# EAGLE design Application_Board (EAGLE 6.4)
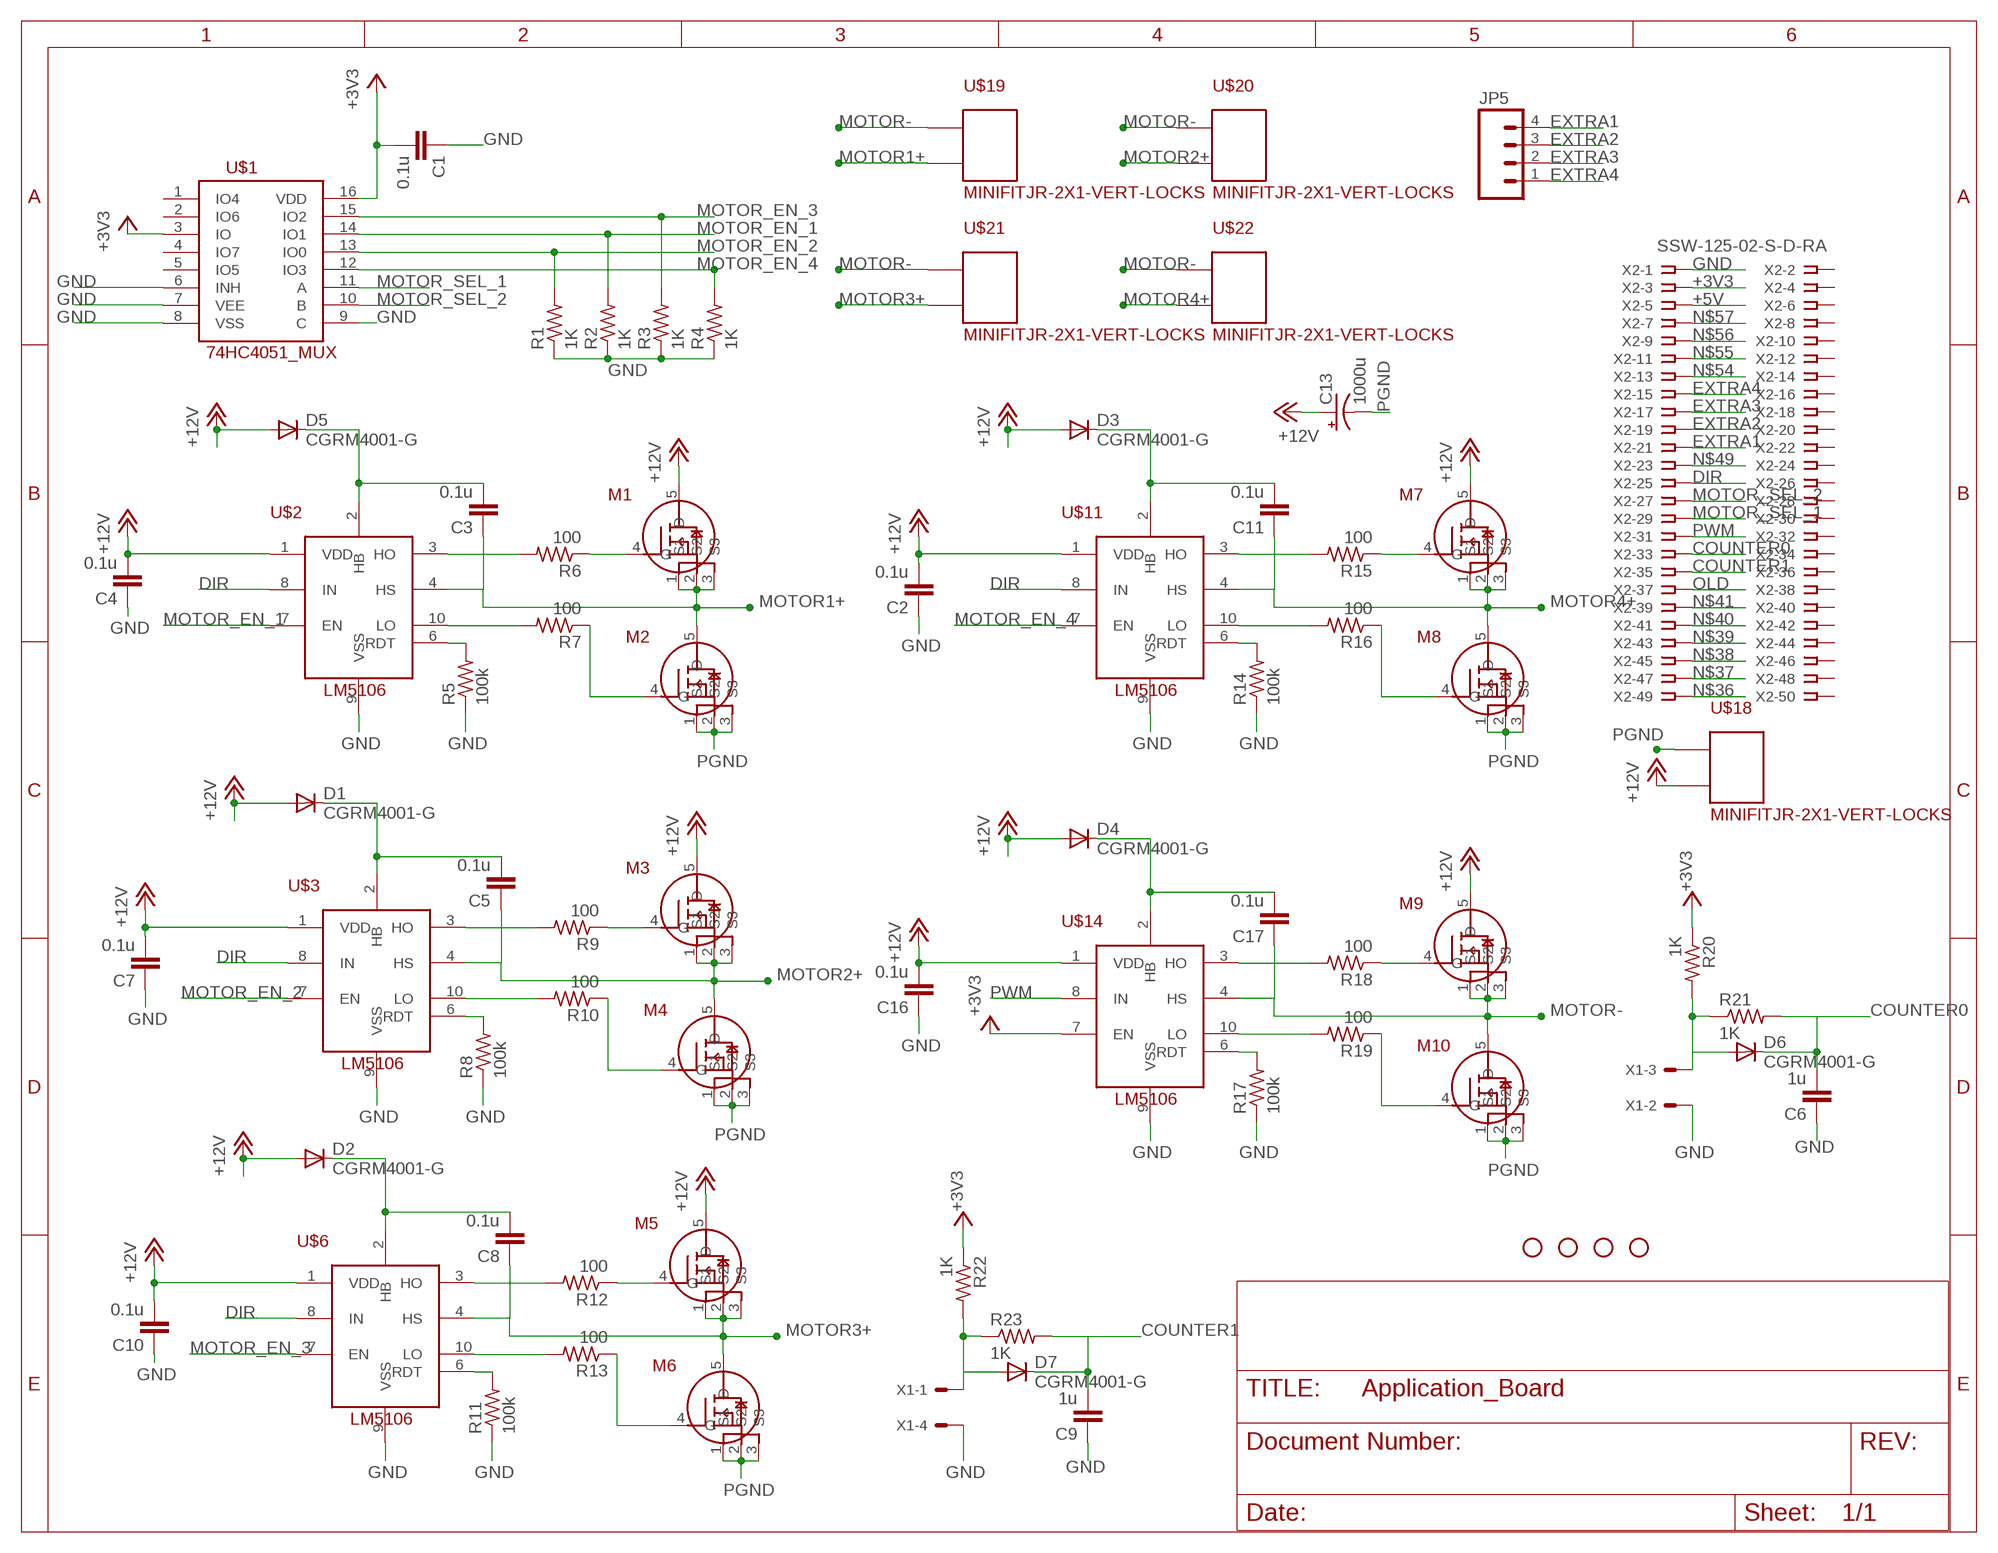
[diagram p0: schematic, sheet 1]

## Parts
C1  0.1u  CAP0805  [0805]
C2  0.1u  CAP0805  [0805]
C3  0.1u  CAP0805  [0805]
C4  0.1u  CAP0805  [0805]
C5  0.1u  CAP0805  [0805]
C6  1u  CAP0805  [0805]
C7  0.1u  CAP0805  [0805]
C8  0.1u  CAP0805  [0805]
C9  1u  CAP0805  [0805]
C10  0.1u  CAP0805  [0805]
C11  0.1u  CAP0805  [0805]
C13  1000u  CPOL-US  [UD-18X19,1_NICHICON]
C16  0.1u  CAP0805  [0805]
C17  0.1u  CAP0805  [0805]
D1  CGRM4001-G  [SOD-123_MINI-SMA]
D2  CGRM4001-G  [SOD-123_MINI-SMA]
D3  CGRM4001-G  [SOD-123_MINI-SMA]
D4  CGRM4001-G  [SOD-123_MINI-SMA]
D5  CGRM4001-G  [SOD-123_MINI-SMA]
D6  CGRM4001-G  [SOD-123_MINI-SMA]
D7  CGRM4001-G  [SOD-123_MINI-SMA]
JP1  STAND-OFF  [STAND-OFF]
JP2  STAND-OFF  [STAND-OFF]
JP3  STAND-OFF  [STAND-OFF]
JP4  STAND-OFF  [STAND-OFF]
JP5  M041X04_NO_SILK  [1X04_NO_SILK]
M1  M  PSMN2R0-30YL  [TO127P600X120-5N]
M2  M  PSMN2R0-30YL  [TO127P600X120-5N]
M3  M  PSMN2R0-30YL  [TO127P600X120-5N]
M4  M  PSMN2R0-30YL  [TO127P600X120-5N]
M5  M  PSMN2R0-30YL  [TO127P600X120-5N]
M6  M  PSMN2R0-30YL  [TO127P600X120-5N]
M7  M  PSMN2R0-30YL  [TO127P600X120-5N]
M8  M  PSMN2R0-30YL  [TO127P600X120-5N]
M9  M  PSMN2R0-30YL  [TO127P600X120-5N]
M10  M  PSMN2R0-30YL  [TO127P600X120-5N]
R1  1K  R-US_R0805  [R0805]
R2  1K  R-US_R0805  [R0805]
R3  1K  R-US_R0805  [R0805]
R4  1K  R-US_R0805  [R0805]
R5  100k  R-US_R0805  [R0805]
R6  100  R-US_R0805  [R0805]
R7  100  R-US_R0805  [R0805]
R8  100k  R-US_R0805  [R0805]
R9  100  R-US_R0805  [R0805]
R10  100  R-US_R0805  [R0805]
R11  100k  R-US_R0805  [R0805]
R12  100  R-US_R0805  [R0805]
R13  100  R-US_R0805  [R0805]
R14  100k  R-US_R0805  [R0805]
R15  100  R-US_R0805  [R0805]
R16  100  R-US_R0805  [R0805]
R17  100k  R-US_R0805  [R0805]
R18  100  R-US_R0805  [R0805]
R19  100  R-US_R0805  [R0805]
R20  1K  R-US_R0805  [R0805]
R21  1K  R-US_R0805  [R0805]
R22  1K  R-US_R0805  [R0805]
R23  1K  R-US_R0805  [R0805]
U$1  74HC4051_MUX  [SO16]
U$2  LM5106MMSMD-MSOP  [10-MSOP]
U$3  LM5106MMSMD-MSOP  [10-MSOP]
U$6  LM5106MMSMD-MSOP  [10-MSOP]
U$11  LM5106MMSMD-MSOP  [10-MSOP]
U$14  LM5106MMSMD-MSOP  [10-MSOP]
U$18  MINIFITJR-2X1-VERT-LOCKS  [5566-02A2]
U$19  MINIFITJR-2X1-VERT-LOCKS  [5566-02A2]
U$20  MINIFITJR-2X1-VERT-LOCKS  [5566-02A2]
U$21  MINIFITJR-2X1-VERT-LOCKS  [5566-02A2]
U$22  MINIFITJR-2X1-VERT-LOCKS  [5566-02A2]
X1  KK-156-4  [KK-156-4]
X2  SSW-125-02-S-D-RA  [TSW-125-02-S-D-RA]

## Nets
+3V3: C1.2 R20.1 R22.1 U$1.3(IO) U$1.16(VDD) U$14.7(EN) X2.3
+5V: X2.5
+12V: C2.2 C4.2 C7.2 C10.2 C13.+ C16.2 D1.A D2.A D3.A D4.A D5.A M1.5(D) M3.5(D) M5.5(D) M7.5(D) M9.5(D) U$2.1(VDD) U$3.1(VDD) U$6.1(VDD) U$11.1(VDD) U$14.1(VDD) U$18.P$2
COUNTER0: C6.2 D6.C R21.2 X2.33
COUNTER1: C9.2 D7.C R23.2 X2.35
DIR: U$2.8(IN) U$3.8(IN) U$6.8(IN) U$11.8(IN) X2.25
EXTRA1: JP5.4 X2.21
EXTRA2: JP5.3 X2.19
EXTRA3: JP5.2 X2.17
EXTRA4: JP5.1 X2.15
GND: C1.1 C2.1 C4.1 C6.1 C7.1 C9.1 C10.1 C16.1 R1.1 R2.1 R3.1 R4.1 R5.1 R8.1 R11.1 R14.1 R17.1 U$1.6(INH) U$1.7(VEE) U$1.8(VSS) U$1.9(C) U$2.9(VSS) U$3.9(VSS) U$6.9(VSS) U$11.9(VSS) U$14.9(VSS) X1.2 X1.4 X2.1
MOTOR1+: C3.1 M1.1(S1) M1.2(S2) M1.3(S3) M2.5(D) U$2.4(HS) U$19.P$2
MOTOR2+: C5.1 M3.1(S1) M3.2(S2) M3.3(S3) M4.5(D) U$3.4(HS) U$20.P$2
MOTOR3+: C8.1 M5.1(S1) M5.2(S2) M5.3(S3) M6.5(D) U$6.4(HS) U$21.P$2
MOTOR4+: C11.1 M7.1(S1) M7.2(S2) M7.3(S3) M8.5(D) U$11.4(HS) U$22.P$2
MOTOR-: C17.1 M9.1(S1) M9.2(S2) M9.3(S3) M10.5(D) U$14.4(HS) U$19.P$1 U$20.P$1 U$21.P$1 U$22.P$1
MOTOR_EN_1: R2.2 U$1.14(IO1) U$2.7(EN)
MOTOR_EN_2: R1.2 U$1.13(IO0) U$3.7(EN)
MOTOR_EN_3: R3.2 U$1.15(IO2) U$6.7(EN)
MOTOR_EN_4: R4.2 U$1.12(IO3) U$11.7(EN)
MOTOR_SEL_1: U$1.11(A) X2.29
MOTOR_SEL_2: U$1.10(B) X2.27
N$1: C3.2 D5.C U$2.2(HB)
N$2: R9.2 U$3.3(HO)
N$3: R10.2 U$3.10(LO)
N$4: M1.4(G) R6.1
N$5: R5.2 U$2.6(RDT)
N$6: C5.2 D1.C U$3.2(HB)
N$7: R8.2 U$3.6(RDT)
N$8: M2.4(G) R7.1
N$9: M3.4(G) R9.1
N$10: M4.4(G) R10.1
N$11: R12.2 U$6.3(HO)
N$12: R13.2 U$6.10(LO)
N$13: C8.2 D2.C U$6.2(HB)
N$14: R11.2 U$6.6(RDT)
N$15: M5.4(G) R12.1
N$16: M6.4(G) R13.1
N$17: R15.2 U$11.3(HO)
N$18: R16.2 U$11.10(LO)
N$19: C11.2 D3.C U$11.2(HB)
N$20: R14.2 U$11.6(RDT)
N$21: M7.4(G) R15.1
N$22: M8.4(G) R16.1
N$23: R18.2 U$14.3(HO)
N$24: R19.2 U$14.10(LO)
N$25: C17.2 D4.C U$14.2(HB)
N$26: R17.2 U$14.6(RDT)
N$27: M9.4(G) R18.1
N$28: M10.4(G) R19.1
N$29: D7.A R22.2 R23.1 X1.1
N$30: D6.A R20.2 R21.1 X1.3
N$36: X2.49
N$37: X2.47
N$38: X2.45
N$39: X2.43
N$40: X2.41
N$41: X2.39
N$49: X2.23
N$54: X2.13
N$55: X2.11
N$56: X2.9
N$57: X2.7
N$67: R6.2 U$2.3(HO)
N$69: R7.2 U$2.10(LO)
OLD: X2.37
PGND: C13.- M2.1(S1) M2.2(S2) M2.3(S3) M4.1(S1) M4.2(S2) M4.3(S3) M6.1(S1) M6.2(S2) M6.3(S3) M8.1(S1) M8.2(S2) M8.3(S3) M10.1(S1) M10.2(S2) M10.3(S3) U$18.P$1
PWM: U$14.8(IN) X2.31
Unconnected: U$1.1(IO4) U$1.2(IO6) U$1.4(IO7) U$1.5(IO5) X2.2 X2.4 X2.6 X2.8 X2.10 X2.12 X2.14 X2.16 X2.18 X2.20 X2.22 X2.24 X2.26 X2.28 X2.30 X2.32 X2.34 X2.36 X2.38 X2.40 X2.42 X2.44 X2.46 X2.48 X2.50

## Library data of the parts
C1-C11 C16 C17 = SparkFun-Capacitors:CAP: Capacitor Standard 0603 ceramic capacitor, and 0.1" leaded capacitor.
C13 = large_cap:CPOL-US: POLARIZED CAPACITOR, American symbol
D1-D7 = diode:CGRM400*-G: Molded plasitc,JEDEC SOD-123/Mini SMA Source: Comchip CGRM4001-G.pdf
JP1-JP4 = SparkFun:STAND-OFF: Stand Off This is the mechanical footprint for a #4 phillips button head screw. Use the keepout ring to avoid running the screw head into surrounding components. SKU : PRT-00447
JP5 = SparkFun-Connectors:M04: Header 4 Standard 4-pin 0.1" header. Use with straight break away headers (SKU : PRT-00116), right angle break away headers (PRT-00553), swiss pins (PRT-00743), machine pins (PRT-00117), and female headers (PRT-00115). Molex polarized connector foot print use with SKU : PRT-08231 with associated crimp pins and housings. 1MM SMD Version SKU: PRT-10208
M1-M10 = nxp_sot669:PSMN2R0-30YL: PSMN2RO-30YL A motor driver N-channel MOSFET from NXP Semiconductor.
R1-R23 = rcl:R-US_: RESISTOR, American symbol
U$1 = SparkFun-AnalogIC:74HC4051_MUX: 8:1 analog mux
U$2 U$3 U$6 U$11 U$14 = half-bridge:LM5106MM: 100V Half Bridge Gate Driver TI LM5106 driver with programmable dead-time
U$18-U$22 = Personal:MINIFITJR-2X1-VERT-LOCKS
X1 = con-molex:KK-156-4: KK 156 HEADER Source: http://www.molex.com/pdm_docs/sd/026604100_sd.pdf; OC_FARNELL: unknown; OC_NEWARK: unknown
X2 = con-samtec:SSW-125-02-S-D: THROUGH-HOLE .025" SQ POST SOCKET Source: Samtec SSW.pdf; MPN: SSW-125-02-S-D-RA; OC_FARNELL: unknown; OC_NEWARK: 11P9724

## Board
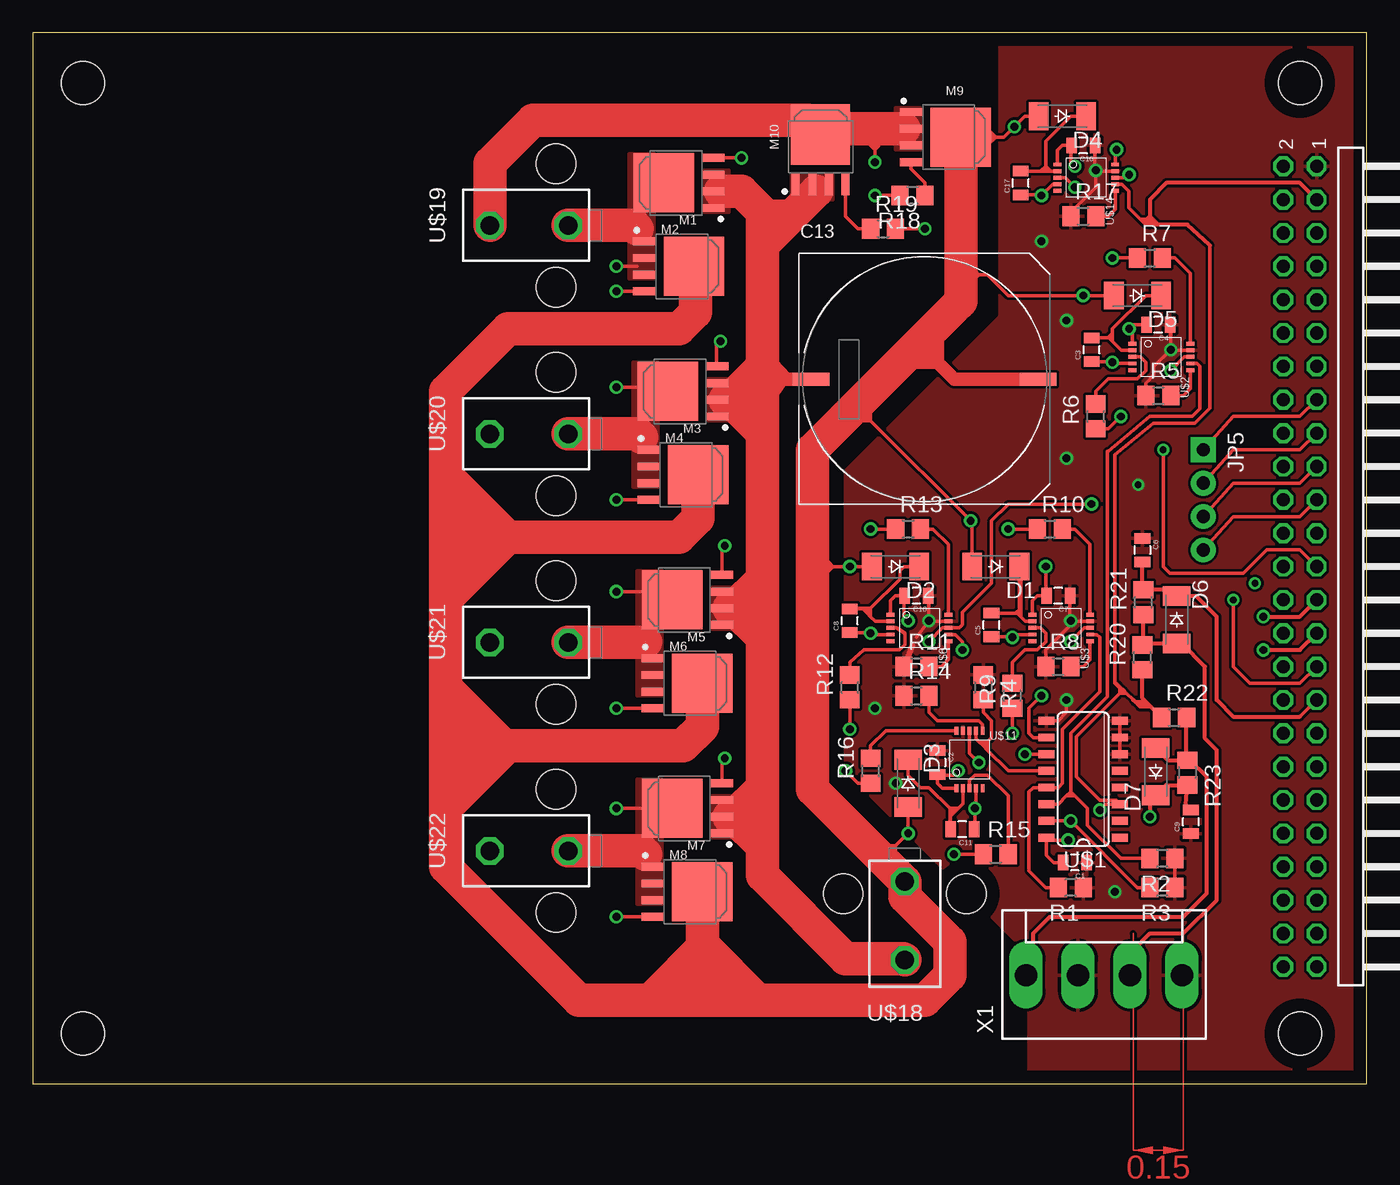
[diagram p1: board, top side]
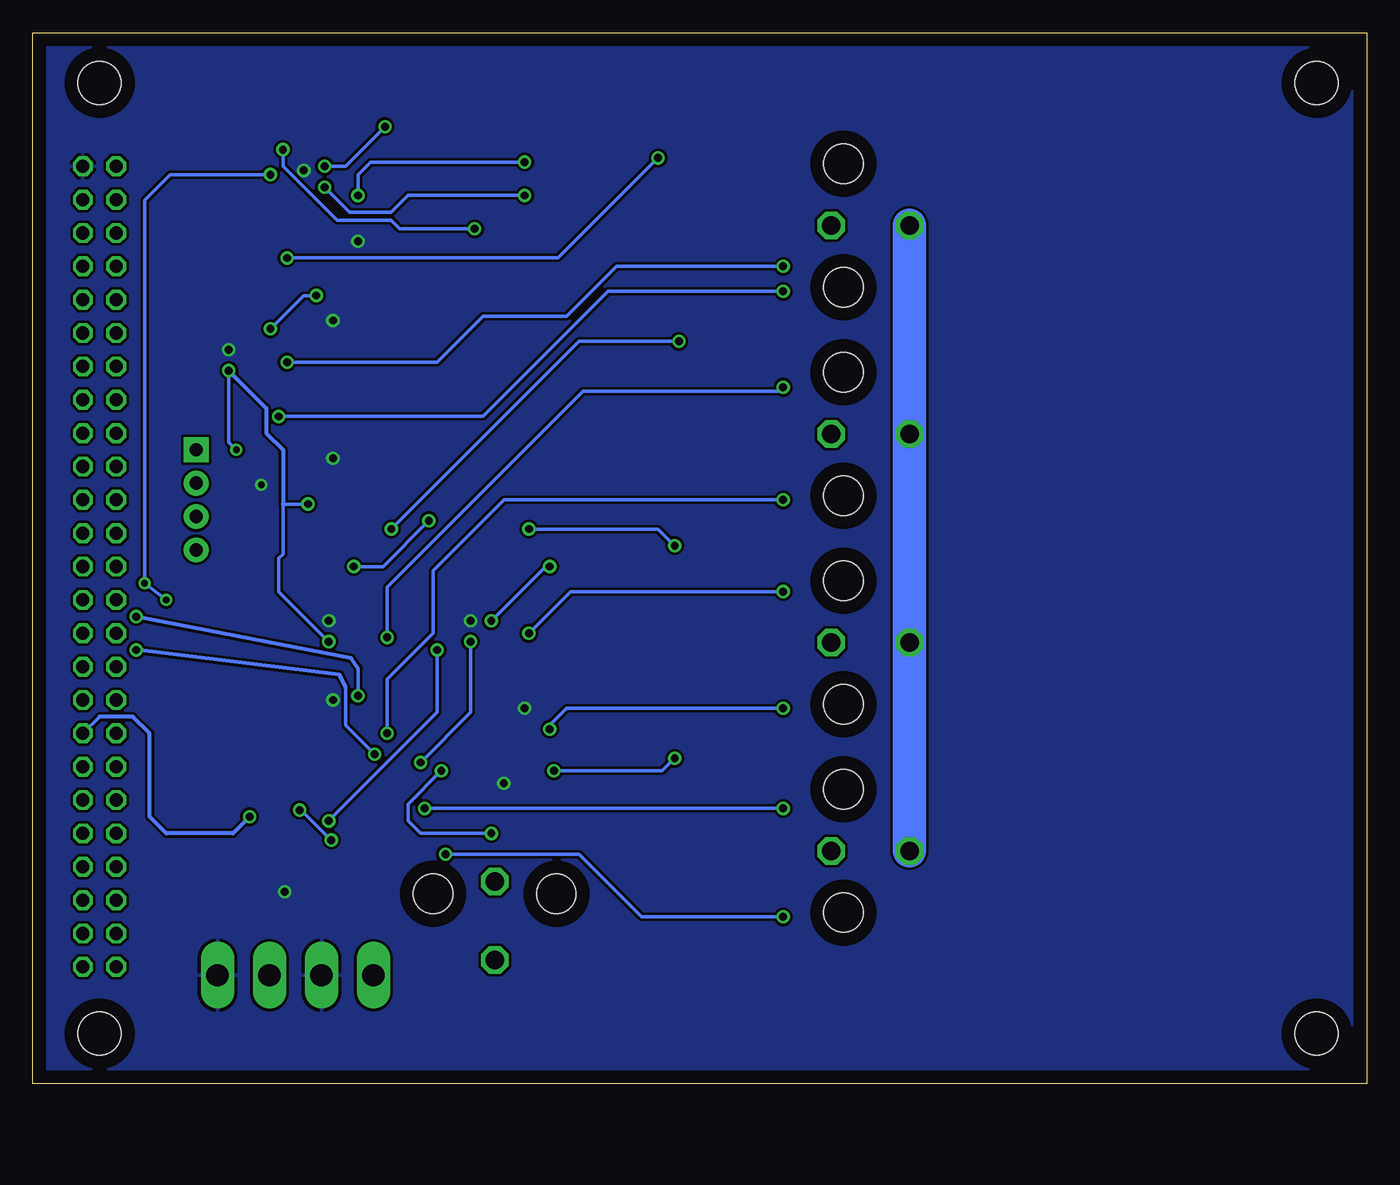
[diagram p2: board, bottom side, seen from below]

Size 101.6 x 80.01 mm. Coordinates in mm from the lower left corner, seen from the top.
Outline: 0,80.01 0,0 101.6,0 101.6,80.01 0,80.01
Copper layers (1*16): Top 0.035mm / dielectric 1.5mm / Bottom 0.035mm
Design rules "default": minimum track width 10mil, minimum drill 15mil, track to track 8mil, track to pad 8mil, pad to pad 8mil, via to via 8mil, smd to smd 8mil, copper to edge 40mil, drill to drill 8mil, minimum pad ring 10mil, minimum via ring 8mil, stop-mask expansion 4mil, vias tented up to drill 0mil, thermal gap 10mil

### Footprints (pad centres in the part's own frame; a part is rotated, then mirrored left to right if it is on the bottom)
0805 = smd 0.8 x 1.2: 1 -0.9,0; 2 0.9,0
UD-18X19,1_NICHICON = smd 2.8 x 1: + 18.15,10.775; - 0.85,10.775
SOD-123_MINI-SMA = smd 1.5 x 2.1: A 1.8,0; C -1.8,0
STAND-OFF = hole 3.302: 0,0
1X04_NO_SILK = drill 1.016 pad 1.88 square: 1 0,0 | drill 1.016 pad 1.88: 2 2.54,0; 3 5.08,0; 4 7.62,0
TO127P600X120-5N = smd 1.65 x 0.6: 1 -2.65,1.905; 2 -2.65,0.635; 3 -2.65,-0.635; 4 -2.65,-1.905 | smd 4.6 x 4.5: 5 1.15,0
R0805 = smd 1.3 x 1.5: 1 -0.95,0; 2 0.95,0
SO16 = smd 0.6 x 1.2: 1 -4.445,-2.8; 2 -3.175,-2.8; 3 -1.905,-2.8; 4 -0.635,-2.8; 5 0.635,-2.8; 6 1.905,-2.8; 7 3.175,-2.8; 8 4.445,-2.8; 9 4.445,2.8; 10 3.175,2.8; 11 1.905,2.8; 12 0.635,2.8; 13 -0.635,2.8; 14 -1.905,2.8; 15 -3.175,2.8; 16 -4.445,2.8
10-MSOP = smd 0.3 x 0.6: 1 0.5,-0.7; 2 1,-0.7; 3 1.5,-0.7; 4 2,-0.7; 5 2.5,-0.7; 6 2.5,3.7; 7 2,3.7; 8 1.5,3.7; 9 1,3.7; 10 0.5,3.7
5566-02A2 = drill 1.4 octagon: P$1 -4.7,-5.5; P$2 -4.7,0.46 | hole 3: -9.4,-0.46; 0,-0.46
KK-156-4 = drill 1.7 pad 2.184 long: 1 -5.94,0; 2 -1.98,0; 3 1.98,0; 4 5.94,0
TSW-125-02-S-D-RA = drill 1 pad 1.5 octagon: 1 30.48,1.524; 2 30.48,4.064; 3 27.94,1.524; 4 27.94,4.064; 5 25.4,1.524; 6 25.4,4.064; 7 22.86,1.524; 8 22.86,4.064; 9 20.32,1.524; 10 20.32,4.064; 11 17.78,1.524; 12 17.78,4.064; 13 15.24,1.524; 14 15.24,4.064; 15 12.7,1.524; 16 12.7,4.064; 17 10.16,1.524; 18 10.16,4.064; 19 7.62,1.524; 20 7.62,4.064; 21 5.08,1.524; 22 5.08,4.064; 23 2.54,1.524; 24 2.54,4.064; 25 0,1.524; 26 0,4.064; 27 -2.54,1.524; 28 -2.54,4.064; 29 -5.08,1.524; 30 -5.08,4.064; 31 -7.62,1.524; 32 -7.62,4.064; 33 -10.16,1.524; 34 -10.16,4.064; 35 -12.7,1.524; 36 -12.7,4.064; 37 -15.24,1.524; 38 -15.24,4.064; 39 -17.78,1.524; 40 -17.78,4.064; 41 -20.32,1.524; 42 -20.32,4.064; 43 -22.86,1.524; 44 -22.86,4.064; 45 -25.4,1.524; 46 -25.4,4.064; 47 -27.94,1.524; 48 -27.94,4.064; 49 -30.48,1.524; 50 -30.48,4.064

### Placement (x,y rotation side)
C1  79.38,16.83 180 top
C2  68.9,24.45 270 top
C3  80.64,55.88 90 top
C4  85.72,57.79 180 top
C5  73.03,34.93 90 top
C6  84.51,40.62 270 top
C7  78.11,37.15 180 top
C8  62.23,35.24 90 top
C9  88.2,19.94 90 top
C10  67.31,37.15 180 top
C11  70.8,19.37 180 top
C13  58.42,42.86 0 top
C16  80.01,71.44 180 top
C17  75.25,68.58 90 top
D1  73.34,39.37 180 top
D2  65.72,39.37 180 top
D3  66.67,22.86 270 top
D4  78.42,73.66 180 top
D5  84.14,60.01 180 top
D6  87.13,35.32 270 top
D7  85.53,23.75 90 top
JP1  3.81,3.81 0 top
JP2  96.52,3.81 0 top
JP3  3.81,76.2 0 top
JP4  96.52,76.2 0 top
JP5  89.15,48.26 270 top
M1  49.21,62.23 0 top
M2  49.21,68.58 180 top
M3  49.53,46.36 0 top
M4  49.53,52.71 180 top
M5  49.85,30.48 0 top
M6  49.85,36.83 180 top
M7  49.85,14.61 0 top
M8  49.85,20.96 180 top
M9  69.53,72.07 0 top
M10  60.01,71.12 90 top
R1  79.06,14.92 180 top
R2  86.04,17.15 180 top
R3  86.04,14.92 180 top
R4  72.39,30.16 270 top
R5  85.72,52.39 0 top
R6  80.96,50.8 90 top
R7  85.09,62.87 0 top
R8  78.11,31.75 0 top
R9  74.61,29.53 90 top
R10  77.47,42.23 0 top
R11  67.31,31.75 0 top
R12  62.23,30.16 90 top
R13  66.67,42.23 0 top
R14  67.31,29.53 0 top
R15  73.34,17.46 0 top
R16  63.82,23.81 90 top
R17  80.01,66.04 0 top
R18  66.99,67.63 180 top
R19  64.77,65.09 0 top
R20  84.52,32.45 90 top
R21  84.59,36.66 90 top
R22  86.93,27.88 0 top
R23  87.95,23.69 270 top
U$1  80.01,23.18 90 top
U$2  84.45,56.83 270 top
U$3  76.83,36.2 270 top
U$6  66.04,36.2 270 top
U$11  69.85,23.18 0 top
U$14  78.74,70.49 270 top
U$18  71.12,14.92 0 top
U$19  40.32,60.64 270 top
U$20  40.32,44.77 270 top
U$21  40.32,28.89 270 top
U$22  40.32,13.02 270 top
X1  81.6,8.26 0 top
X2  99.31,39.37 90 top

### Tracks (layer width: path | path; a pad name or v marks a point on that pad's centre or on a via)
+3V3  (via drill 0.6)
  Top 0.254: 78.42,16.83 77.79,16.83 77.21,17.41 U$1.16 77.4,18.54 v78.87,18.54 | 89.66,63.82 89.66,51.44 88.52,50.29 85.34,50.29 82.42,47.88 82.42,30.61 | 85.72,65.41 85.09,65.41 84.77,65.41 83.5,66.68 83.5,67.95 82.96,68.49 U$14.7 | 82.42,30.61 82.42,30.48 | 83.06,29.97 83.31,29.72 | 83.31,29.72 83.82,29.21 84.33,28.7 | v81.28,20.83 81.72,21.27 U$1.3 | 82.87,21.27 82.55,21.59 81.28,21.59 79.5,23.37 79.5,26.42 82.8,29.72 | 82.8,29.72 83.06,29.97 | 83.06,29.97 82.8,30.23 | 82.8,30.23 82.55,30.48 | 82.42,30.61 82.55,30.48 | 82.55,30.48 82.42,30.48 | 82.42,30.48 82.93,29.97 | 82.8,30.23 82.8,29.72 | 83.31,29.72 82.8,29.72
  Top 0.305: X2.3 96.52,68.58 86.36,68.58 85.09,67.31 85.09,66.04 | 85.09,66.04 85.09,65.41 | 84.84,65.79 84.71,65.66 84.84,65.53 85.34,65.53 | 85.09,66.04 85.72,65.41 87.95,65.41 89.66,63.82 | 85.09,66.04 84.84,65.79 | 84.84,65.79 84.45,65.79 | 85.16,28.7 84.33,28.7 | R22.1 85.16,28.7 | 85.16,28.7 84.52,29.34 R20.1 | 83.82,29.21 83.95,29.08 84.71,29.08 84.71,28.83 84.58,28.96 84.33,28.96
  Top 0.406: 82.87,21.27 U$1.3 | C1.2 78.42,16.83
  Bottom 0.254: v78.87,18.54 81.15,20.83 v81.28,20.83
+12V  (via drill 0.6)
  Top 0.254: U$14.1 78.04,71.06 78.42,71.44 79.06,71.44 | U$3.1 76.14,36.77 76.52,37.15 77.15,37.15 | 77.15,37.15 C7.2 | U$6.1 65.34,36.77 65.72,37.15 66.36,37.15 66.36,35.56 v66.67,35.24 | U$11.1 69.28,22.48 68.9,22.86 68.9,23.5 | 68.9,23.5 C2.2 | 65.72,18.1 v66.67,19.05 D3.A | 65.72,18.1 64.71,17.09 | 65.41,18.1 65.72,18.1 | 65.72,18.1 65.72,17.46 | D1.A 71.54,42.76 v71.44,42.86 63.82,50.48 | 63.82,50.48 63.5,50.8 | 63.5,50.8 62.55,50.8 | 62.87,50.17 63.18,50.48 | 63.18,50.48 63.5,50.8 | D4.A 75.56,73.66 v74.77,72.87 73.98,72.07 73.34,72.07 | 73.03,72.07 M9.5 | 73.34,72.07 72.71,72.71 72.71,72.39 73.03,72.07 | 73.03,72.07 73.34,72.07 | 73.34,72.07 72.71,71.44 72.71,71.76 73.03,72.07 | 60.96,39.37 60.64,39.37 | 60.64,39.37 60.01,39.37 | 60.64,39.69 60.33,40.01 60.33,39.69 60.64,39.37 | 60.64,39.37 60.64,39.69 | 60.64,39.69 60.96,39.37 | 60.96,39.37 60.33,38.74 60.33,39.05 60.64,39.37 | D5.A v80.01,60.01 74.3,60.01 72.71,61.6 72.07,61.6 | 72.07,61.6 71.44,61.6 71.12,61.28 | 72.07,61.6 71.75,61.91 | 72.07,61.6 71.75,61.28 | D2.A v62.23,39.37 | 60.96,39.37 v62.23,39.37 | 68.9,23.5 70.17,23.5 v70.48,23.81 | 77.15,37.15 v77.15,39.37 | 63.82,50.48 63.18,50.48 | 63.82,50.48 63.82,51.12 | U$2.1 83.75,57.22 v83.5,57.47 83.82,57.79 84.77,57.79 | 79.06,71.44 C16.2 | 79.06,71.44 79.06,70.17 v79.38,69.85 | v62.23,39.37 59.37,39.37
  Top 0.406: 59.37,48.26 60.01,48.26 62.55,50.8 | 68.9,57.15 68.9,57.79 70.48,59.37 | 70.68,59.57 70.68,60.84 71.12,61.28 | C10.2 66.36,37.15 | 84.77,57.79 C4.2 | 70.48,72.07 M9.5
  Top 1.016: C13.+ 70.19,53.64 68.9,54.93 | 68.9,54.93 67.63,56.2 | 68.9,57.15 68.9,54.93 | 68.9,54.93 66.67,54.93
  Top 2.54: M5.5 51,27.19 49.53,25.72 36.2,25.72 | 36.2,25.72 31.43,20.96 | 31.43,20.96 31.43,25.72 | 31.43,25.72 31.43,28.26 | 31.43,30.16 31.43,36.83 | 31.43,36.83 31.43,41.59 | 31.43,41.59 31.43,44.13 | 31.43,46.36 31.43,52.71 36.2,57.47 49.21,57.47 50.48,58.74 50.48,62.11 M1.5 | M3.5 50.68,43.06 49.21,41.59 36.2,41.59 | 36.2,41.59 31.43,36.83 | 36.2,25.72 35.88,25.72 | 35.88,25.72 33.02,25.72 | 31.43,25.72 33.02,25.72 | 33.02,25.72 33.02,24.45 | 35.88,25.72 31.43,30.16 | 31.43,30.16 31.43,28.26 | 31.43,28.26 32.7,26.99 | 36.2,41.59 31.43,41.59 | 31.43,41.59 33.02,40.01 | 36.2,41.59 31.43,46.36 | 31.43,46.36 31.43,44.13 | 31.43,44.13 33.34,42.23 | 55.24,6.35 67.94,6.35 69.85,8.26 69.85,10.8 66.42,14.23 U$18.P$2 64.71,17.09 59.37,22.43 59.37,39.37 59.37,48.26 70.48,59.37 70.68,59.57 M9.5 | 55.24,6.35 51.12,6.35 | 51.12,6.35 41.59,6.35 31.43,16.51 31.43,20.96 | M7.5 51,6.47 51.12,6.35 | 55.24,6.35 51.12,10.48 47.31,6.67
  Bottom 0.254: v70.48,23.81 73.03,21.27 73.03,20 72.07,19.05 v66.67,19.05 | v77.15,39.37 74.93,39.37 v71.44,42.86 | v83.5,57.47 80.96,60.01 v80.01,60.01 | v79.38,69.85 77.79,69.85 v74.77,72.87 | v66.67,35.24 62.55,39.37 v62.23,39.37
COUNTER0
  Top 0.254: 96.52,27.94 X2.33
  Top 0.305: 96.52,27.94 91.44,27.94 90.17,29.21 90.17,35.56 88.61,37.12 D6.C 86.64,37.61 R21.2 84.51,37.68 C6.2
COUNTER1  (via drill 0.6)
  Top 0.305: C9.2 87.82,21.22 R23.2 86.32,22.74 D7.C 85.09,21.51 v85.09,20.32
  Bottom 0.254: 96.52,27.94 X2.35
  Bottom 0.305: v85.09,20.32 86.36,19.05 91.44,19.05 92.71,20.32 92.71,26.67 93.98,27.94 96.52,27.94
DIR  (via drill 0.51, 0.6)
  Top 0.254: U$2.8 87.72,55.33 v86.68,54.29 | v79.06,33.66 80.1,34.7 U$3.8 | v80.64,44.13 74.3,44.13 73.03,42.86 73.03,38.1 70.8,35.88 70.8,34.93 70.57,34.7 U$6.8 69.3,34.7 v68.26,33.66 | v72.07,24.45 71.35,25.17 U$11.8 | X2.25 96.52,40.64 93.98,40.64 92.2,38.86 86.61,38.86 86.11,39.37 v86.11,48.26
  Bottom 0.254: v86.68,54.29 86.68,48.83 v86.11,48.26 | v79.06,33.66 82.87,37.47 82.87,40.01 82.55,40.32 82.55,44.13 v80.64,44.13 | v68.26,33.66 68.26,28.26 v72.07,24.45
  Bottom 0.305: v86.68,54.29 83.82,51.44 83.82,49.53 82.55,48.26 82.55,44.13
EXTRA1
  Top 0.254: X2.21 96.52,43.18 91.44,43.18 JP5.4
EXTRA2
  Top 0.254: X2.19 96.52,45.72 91.44,45.72 JP5.3
EXTRA3
  Top 0.254: X2.17 96.52,48.26 91.44,48.26 JP5.2
EXTRA4
  Top 0.254: X2.15 96.52,50.8 91.44,50.8 JP5.1
GND  (via drill 0.51, 0.6)
  Top 0.254: U$14.9 81.01,69.49 v80.96,69.53 | C16.1 80.91,69.59 v80.96,69.53 | R17.1 79.06,66.36 80.96,68.26 v80.96,69.53 | U$1.6 82.81,26.3 82.87,26.35 | U$1.8 U$1.7 | U$3.9 79.11,35.2 v79.06,35.24 | C7.1 79,35.3 v79.06,35.24 | v79.06,35.24 79.06,34.93 77.15,33.02 R8.1 | v86.68,55.88 86.68,57.47 | v86.68,55.88 86.72,55.83 U$2.9 | v86.68,55.88 85.41,54.61 85.41,53.98 84.77,53.34 R5.1 | v68.26,35.24 68.26,37.1 C10.1 | U$6.9 68.31,35.2 v68.26,35.24 | v68.26,35.24 67.31,33.97 | R3.1 R2.1 | U$1.9 78.11,27.62 78.74,28.26 v78.74,29.21
  Top 0.406: R11.1 66.99,33.34
  other vias: 78.74,47.63 64.14,28.58 78.74,58.1 76.83,64.14 82.42,14.61 84.2,45.59 65.72,22.86
  pour Bottom: 101.28,79.69 0,80.01 0,-0.32 101.28,-0.32
  pour Top: 101.28,79.69 73.66,79.69 73.66,58.42 61.91,46.67 61.91,23.81 75.88,9.84 75.88,-0.32 101.28,-0.32
MOTOR1+  (via drill 0.6)
  Top 0.254: 80.74,54.83 80.64,54.93 | U$2.4 82.33,54.83 v82.23,54.93 82.18,54.98 C3.1 | v44.45,62.23 46.04,62.23
  Top 0.406: 80.64,54.93 C3.1
  Top 2.54: U$19.P$2 45.78,65.34 46.04,65.09
  Bottom 0.254: v44.45,62.23 57.15,62.23 60.96,58.42 67.31,58.42 70.8,54.93 v82.23,54.93
  pour Top (no thermals): 47.31,61.28 45.4,61.28 45.4,70.8 47.31,70.8
MOTOR2+  (via drill 0.6)
  Top 0.254: U$3.4 74.83,34.2 v74.61,33.97 74.56,34.03 C5.1 | v44.45,53.02 48.06,53.02 M4.5
  Top 2.54: U$20.P$2 46.1,49.47 46.35,49.21
  Bottom 0.254: v74.61,33.97 74.61,37.78 59.69,52.71 44.77,52.71 v44.45,53.02
  pour Top (no thermals): 47.62,45.4 45.72,45.4 45.72,54.93 47.62,54.93
MOTOR3+  (via drill 0.6)
  Top 0.254: C8.1 63.77,34.34 v63.82,34.29 63.91,34.2 U$6.4 | v44.45,37.47 46.67,37.47
  Top 2.54: U$21.P$2 46.61,33.59 46.67,33.66
  Bottom 0.254: v63.82,34.29 60.64,37.47 v44.45,37.47
  pour Top (no thermals): 46.04,29.53 47.94,29.53 47.94,39.05 46.04,39.05
MOTOR4+  (via drill 0.6)
  Top 0.254: C11.1 71.75,19.42 v71.75,20.96 71.85,21.05 U$11.4 | v44.45,20.96 47.94,20.96
  Top 2.54: U$22.P$2 46.42,17.72 46.67,17.46
  Bottom 0.254: v71.75,20.96 v44.45,20.96
  pour Top (no thermals): 47.94,13.65 47.94,23.18 46.04,23.18 46.04,13.65
MOTOR-  (via drill 0.6)
  Top 0.254: C17.1 76.78,67.68 v76.83,67.63 77.69,68.49 U$14.4 | v64.14,70.17 64.14,71.12 | 64.14,71.12 64.14,71.44 | 64.14,71.44 64.14,72.07 64.77,72.71 66.36,72.71 | 64.14,71.12 64.77,71.76 | 64.14,71.12 63.5,71.76 63.82,71.76 64.14,71.44
  Top 0.406: 60.01,72.39 M10.5
  Top 2.54: U$19.P$1 34.82,70.07 38.1,73.34 59.05,73.34 60.01,72.39 | M10.5 60.45,72.71 66.36,72.71
  Bottom 0.254: v76.83,67.63 76.83,69.22 75.88,70.17 v64.14,70.17
  Bottom 2.54: U$20.P$1 U$19.P$1 U$21.P$1 U$22.P$1
  pour Top (no thermals): 65.72,74.3 65.72,71.12 67.63,71.12 67.63,74.3
MOTOR_EN_1
  Top 0.254: U$2.7 88.68,54.83 88.9,54.61 88.9,51.37 88.33,50.8 85.09,50.8 81.92,48.13 81.85,48.13 81.85,29.46 79.06,26.67 79.06,22.23 | U$1.14 78.11,21.27 78.74,21.91 | 78.74,21.91 79.06,22.23 | R2.2 82.87,17.15 80.33,19.69 80.33,20.96 79.38,21.91 | 79.38,21.91 79.06,22.23 | 79.38,21.91 79.06,21.91 | 78.74,21.91 79.06,21.91 | 79.06,21.91 79.06,22.23
MOTOR_EN_2
  Top 0.254: U$3.7 81.06,34.2 81.28,33.97 81.28,29.85 78.42,26.99 78.42,22.86 78.11,22.54 U$1.13 | R1.2 77.15,14.92 75.88,16.19 75.88,22.23 76.2,22.54 77.15,22.54
  Top 0.406: U$1.13 77.15,22.54
MOTOR_EN_3  (via drill 0.6)
  Top 0.254: U$6.7 70.26,34.2 70.8,33.66 v70.8,33.02 | U$1.15 v79.06,20 84.14,14.92 R3.2
  Top 0.406: 77.15,20 U$1.15
  Bottom 0.254: v70.8,33.02 70.8,28.26 v79.06,20
MOTOR_EN_4
  Top 0.254: U$11.7 71.85,26.26 72.07,26.04 | 72.07,26.04 72.39,25.72 | 72.39,25.72 72.71,25.4 | 72.71,25.4 74.3,23.81 U$1.12 | R4.2 72.39,28.26 73.03,27.62 73.03,26.35 72.71,26.04 | 72.71,26.04 72.39,25.72 | 72.39,25.72 72.39,26.04 | 72.39,26.04 72.07,26.04 | 72.39,26.04 72.71,26.04 | 72.71,26.04 72.71,25.72 | 72.71,25.4 72.71,25.72 | 72.71,25.72 72.39,25.72
MOTOR_SEL_1  (via drill 0.6)
  Top 0.254: U$1.11 v75.56,25.08
  Top 0.305: v93.73,33.02 96.52,33.02 X2.29
  Bottom 0.254: v75.56,25.08 77.79,27.31 77.79,30.16
  Bottom 0.305: 77.79,30.16 78.23,31.12 v93.73,33.02
MOTOR_SEL_2  (via drill 0.6)
  Top 0.254: U$1.10 76.2,26.35 75.88,26.67 75.88,28.58 v76.83,29.53
  Top 0.305: v93.73,35.56 96.52,35.56 X2.27
  Bottom 0.254: 76.83,31.62 v76.83,29.53
  Bottom 0.305: 76.83,31.62 77.34,32.39 v93.73,35.56
N$1
  Top 0.254: U$2.2 82.92,55.83 82.23,56.52 | 82.23,56.52 81.97,56.78 | C3.2 81.97,56.78 | D5.C 84.77,60.01 82.23,57.47 82.23,57.15 | 81.97,56.78 82.18,56.78 82.23,56.83 | 82.23,56.83 82.23,56.52 | 82.23,56.83 82.23,57.15 | 81.92,56.83 82.23,57.15
N$2
  Top 0.254: U$3.3 76.75,34.7 77.15,34.29 77.15,33.66 76.52,33.02 75.56,33.02 74.61,32.07 R9.2
  Top 0.406: R9.2
N$3
  Top 0.254: U$3.10 80.53,41.07 79.38,42.23 R10.2
  Top 0.406: R10.2
N$4  (via drill 0.6)
  Top 0.254: R6.1 81.92,49.85 v82.87,50.8 | v44.45,60.33 M1.4
  Bottom 0.254: v44.45,60.33 57.78,60.33 67.31,50.8 v82.87,50.8
N$5
  Top 0.254: U$2.6 88.16,52.91 87.63,52.39 R5.2
N$6
  Top 0.254: C5.2 74.98,35.83 75.25,35.56 | 75.25,35.56 75.61,35.2 U$3.2 | D1.C 75.14,36.09 | 75.14,36.09 74.93,35.88 75.25,35.88 | 75.14,36.09 75.25,36.2 | 75.25,36.2 75.25,39.05 | 75.25,36.2 75.25,35.88 | 75.25,35.88 75.25,35.56
N$7
  Top 0.254: U$3.6 80.53,32.28 80.01,31.75 R8.2
N$8  (via drill 0.6)
  Top 0.254: R7.1 v82.23,62.87 | v53.98,70.49 M2.4
  Bottom 0.254: v53.98,70.49 61.59,62.87 v82.23,62.87
N$9  (via drill 0.6)
  Top 0.254: R9.1 v74.61,26.67 | v44.45,44.45 M3.4
  Bottom 0.254: v74.61,26.67 74.61,30.8 71.12,34.29 71.12,39.05 65.72,44.45 v44.45,44.45
N$10  (via drill 0.6)
  Top 0.254: R10.1 v74.3,42.23 | v52.39,56.52 52.07,56.2 52.07,54.61 M4.4
  Bottom 0.254: v74.3,42.23 60.01,56.52 v52.39,56.52
N$11
  Top 0.254: U$6.3 65.64,34.7 65.8,34.7 66.43,34.28 66.43,33.43 66.03,33.02 63.31,33.02 62.23,32.07 R12.2
N$12
  Top 0.254: U$6.10 69.74,41.07 68.58,42.23 R13.2
  Top 0.406: R13.2
N$13
  Top 0.254: U$6.2 64.18,35.2 63.82,35.56 | C8.2 63.23,36.14 63.5,35.88 | 63.5,35.88 63.82,35.56 | D2.C 66.36,39.37 66.04,39.05 66.04,38.42 63.82,36.2 | 63.82,36.2 63.5,35.88 | 63.5,36.2 63.82,36.2 | 62.55,36.2 63.5,36.2 | 63.5,36.2 63.5,35.88 | 63.82,36.2 63.82,35.88 | 63.82,35.56 63.82,35.88 | 63.82,35.88 63.5,35.88
N$14
  Top 0.254: U$6.6 69.74,32.28 69.22,31.75 R11.2
N$15  (via drill 0.6)
  Top 0.254: R12.1 v62.23,26.99 | v44.45,28.58 M5.4
  Bottom 0.254: v62.23,26.99 62.23,27.31 60.96,28.58 v44.45,28.58
N$16  (via drill 0.6)
  Top 0.254: R13.1 v63.82,42.23 | v52.7,40.96 52.5,40.75 M6.4
  Bottom 0.254: v63.82,42.23 53.98,42.23 v52.7,40.96
N$17
  Top 0.254: U$11.3 71.35,23.09 71.75,23.5 72.71,23.5 74.3,21.91 R15.2
N$18
  Top 0.254: U$11.10 64.98,26.88 63.82,25.72 R16.2
N$19
  Top 0.254: U$11.2 70.85,21.32 70.48,20.96 | C11.2 69.9,20.37 70.17,20.64 | 70.17,20.64 70.48,20.96 | D3.C 66.67,23.5 67.63,22.54 68.26,22.54 69.85,20.96 | 69.85,20.96 70.17,20.64 | 70.17,20.64 69.85,20.64 | 69.85,20.64 69.85,20.96 | 69.85,20.64 69.85,19.37 | 70.17,20.96 69.85,20.96 | 70.48,20.96 70.17,20.96 | 70.17,20.96 70.17,20.64
N$20
  Top 0.254: U$11.6 72.35,27.35 72.07,27.62 68.9,27.62 68.26,28.26 R14.2
  Top 0.406: R14.2
N$21  (via drill 0.6)
  Top 0.254: R15.1 v70.17,17.46 | v44.45,12.7 M7.4 47.31,12.7
  Bottom 0.254: v70.17,17.46 60.01,17.46 55.24,12.7 v44.45,12.7
N$22  (via drill 0.6)
  Top 0.254: R16.1 62.86,22.86 v61.91,23.81 | v52.7,24.77 52.5,24.56 M8.4
  Bottom 0.254: v61.91,23.81 53.66,23.81 v52.7,24.77
N$23  (via drill 0.6)
  Top 0.254: R18.2 v64.14,67.63 | U$14.3 78.65,68.99 v79.38,68.26
  Bottom 0.254: v64.14,67.63 73.03,67.63 74.3,66.36 77.47,66.36 v79.38,68.26
N$24  (via drill 0.6)
  Top 0.254: R19.2 v67.94,65.09 | U$14.10 82.44,71.01 v82.55,71.12
  Bottom 0.254: v67.94,65.09 73.66,65.09 74.3,65.72 78.42,65.72 82.55,69.85 v82.55,71.12
N$25
  Top 0.254: U$14.2 77.15,69.49 | 77.15,69.49 76.56,69.49 76.25,69.48 C17.2 | D4.C 79.06,73.66 77.15,71.76 77.15,69.85 | 77.15,69.85 77.15,69.49 | 77.47,69.53 77.15,69.85 | 77.15,69.85 76.83,69.53
N$26
  Top 0.254: U$14.6 82.44,66.57 81.92,66.04 R17.2
  Top 0.406: R17.2
N$27
  Top 0.254: M9.4 66.88,69.64 67.94,68.58 R18.1
  Top 0.406: R18.1
N$28
  Top 0.254: M10.4 61.91,66.04 62.87,65.09 R19.1
N$29
  Top 0.305: D7.A 86.45,24.64 R23.1 | X1.1 76.2,8.8 76.2,11.43 77.47,12.7 87.63,12.7 89.41,14.48 89.41,23.37 88.14,24.64 R23.1 | R23.1 87.88,24.7 R22.2
N$30
  Top 0.305: X1.3 83.82,8.5 83.82,10.16 85.09,11.43 87.63,11.43 90.17,13.97 90.17,25.4 89.28,26.29 89.28,31.75 87.51,33.52 D6.A 84.64,33.52 R20.2 84.59,33.47 R21.1
N$67
  Top 0.254: U$2.3 84.37,55.33 84.77,54.93 84.77,54.29 84.14,53.66 81.92,53.66 80.96,52.71 R6.2
N$69
  Top 0.254: U$2.10 88.16,61.71 87,62.87 R7.2
  Top 0.406: R7.2
PGND
  Top 0.406: 55.24,54.29 55.24,54.93 55.88,54.93
  Top 1.016: C13.- 55.9,53.64 55.88,54.93
  Top 2.54: 52.39,67.95 53.98,67.95 55.56,66.36 55.56,66.04 | 55.56,63.82 55.56,52.07 | 55.56,52.07 55.56,38.42 | 55.56,38.42 55.56,36.2 | 55.56,36.2 55.56,33.97 | 55.56,33.97 55.56,22.54 | 55.56,22.54 55.56,20.32 | 55.56,20.32 55.56,18.1 | 55.56,52.07 53.02,52.07 | 53.02,52.07 55.24,54.29 | 52.7,52.07 53.02,52.07 | 53.02,52.07 55.24,49.85 | 53.66,36.2 55.56,36.2 | 53.34,36.2 55.56,38.42 | 53.02,36.2 53.34,36.2 | 53.34,36.2 55.56,33.97 | 53.34,20.32 55.56,20.32 | 53.34,20.32 55.56,18.1 | 53.02,20.32 53.34,20.32 | 53.34,20.32 55.56,22.54 | U$18.P$1 66.32,9.53 61.91,9.53 55.56,15.88 55.56,18.1 | 55.56,66.04 55.56,63.82 | 55.56,63.82 57.78,66.04 | 57.78,66.04 59.69,67.95 | 57.78,66.04 55.56,66.04
  pour Top (no thermals): 60.96,69.22 57.78,69.22 57.78,67.31 60.96,67.31
  pour Top (no thermals): 51.12,69.53 53.02,69.53 53.02,66.36 51.12,66.36
  pour Top (no thermals): 53.34,50.48 51.44,50.48 51.44,53.66 53.34,53.66
  pour Top (no thermals): 51.75,34.61 51.75,37.78 53.66,37.78 53.66,34.61
  pour Top (no thermals): 51.75,18.73 53.66,18.73 53.66,21.91 51.75,21.91
PWM  (via drill 0.51, 0.6)
  Top 0.254: v83.5,69.22 83.42,68.99 U$14.8 | v91.44,36.83 91.44,31.75 92.71,30.48 96.52,30.48 X2.31
  Bottom 0.254: v83.5,69.22 91.12,69.22 93.09,67.25 v93.09,38.1 v91.44,36.83
S$1
  Top 0.61: 56.5,54.87 57.43,53.87 56.47,52.42
(copper drawn outside any net)
  shapes: Top area x1